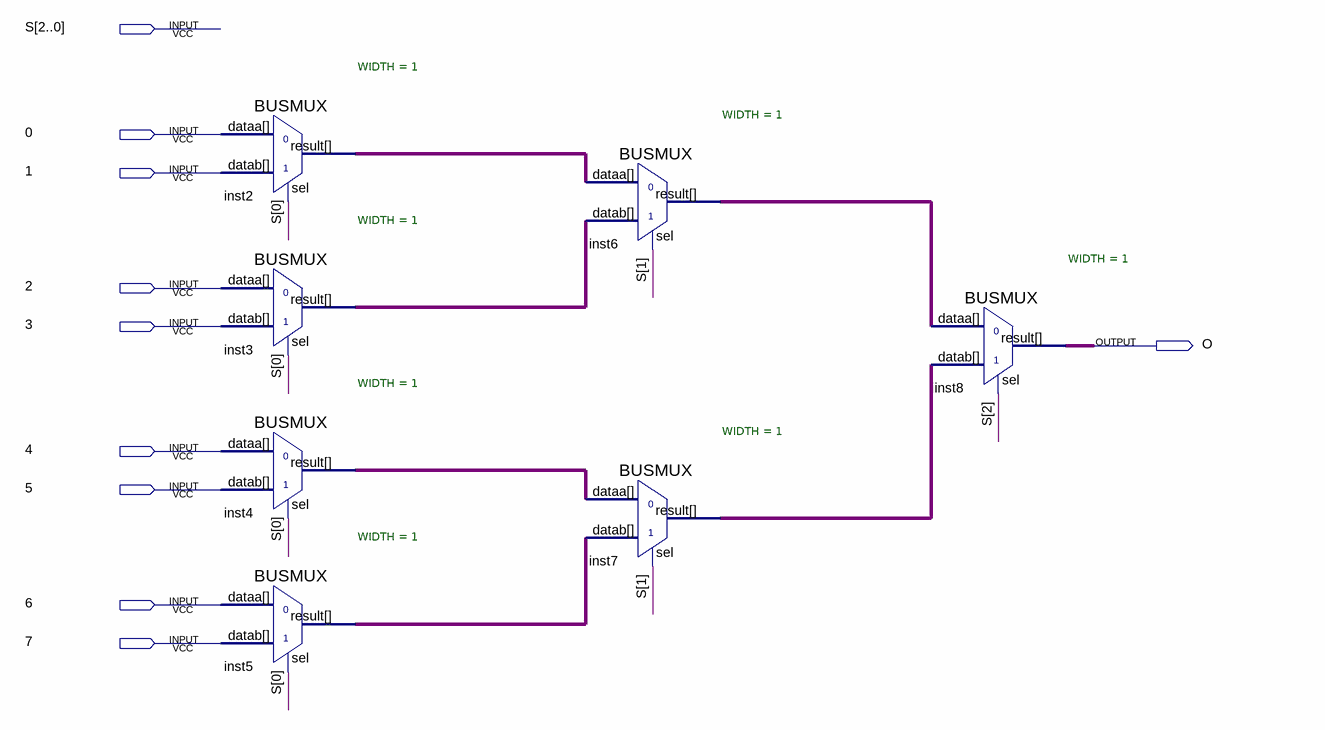
[diagram p0: schematic sheet]
// Quartus schematic MUX8_1_1BIT.bdf as structural Verilog: 7 symbols, 10 pins
module MUX8_1_1BIT (
  input  [2:0] S,
  input  \0 ,
  input  \1 ,
  input  \2 ,
  input  \3 ,
  input  \4 ,
  input  \5 ,
  input  \6 ,
  input  \7 ,
  output O
);

  wire inst2_result, inst3_result, inst4_result, inst5_result, inst6_result, inst7_result;

  BUSMUX #(.WIDTH(1)) inst2 (.datab(\1 ), .sel(S[0]), .dataa(\0 ), .result(inst2_result));
  BUSMUX #(.WIDTH(1)) inst3 (.datab(\3 ), .sel(S[0]), .dataa(\2 ), .result(inst3_result));
  BUSMUX #(.WIDTH(1)) inst4 (.datab(\5 ), .sel(S[0]), .dataa(\4 ), .result(inst4_result));
  BUSMUX #(.WIDTH(1)) inst5 (.datab(\7 ), .sel(S[0]), .dataa(\6 ), .result(inst5_result));
  BUSMUX #(.WIDTH(1)) inst6 (.datab(inst3_result), .sel(S[1]), .dataa(inst2_result), .result(inst6_result));
  BUSMUX #(.WIDTH(1)) inst7 (.datab(inst5_result), .sel(S[1]), .dataa(inst4_result), .result(inst7_result));
  BUSMUX #(.WIDTH(1)) inst8 (.datab(inst7_result), .sel(S[2]), .dataa(inst6_result), .result(O));
endmodule
